# Altium schematic sheet Amplifier.SchDoc
size 594 x 420 mm; SheetNumber: 1; SheetTotal: 1
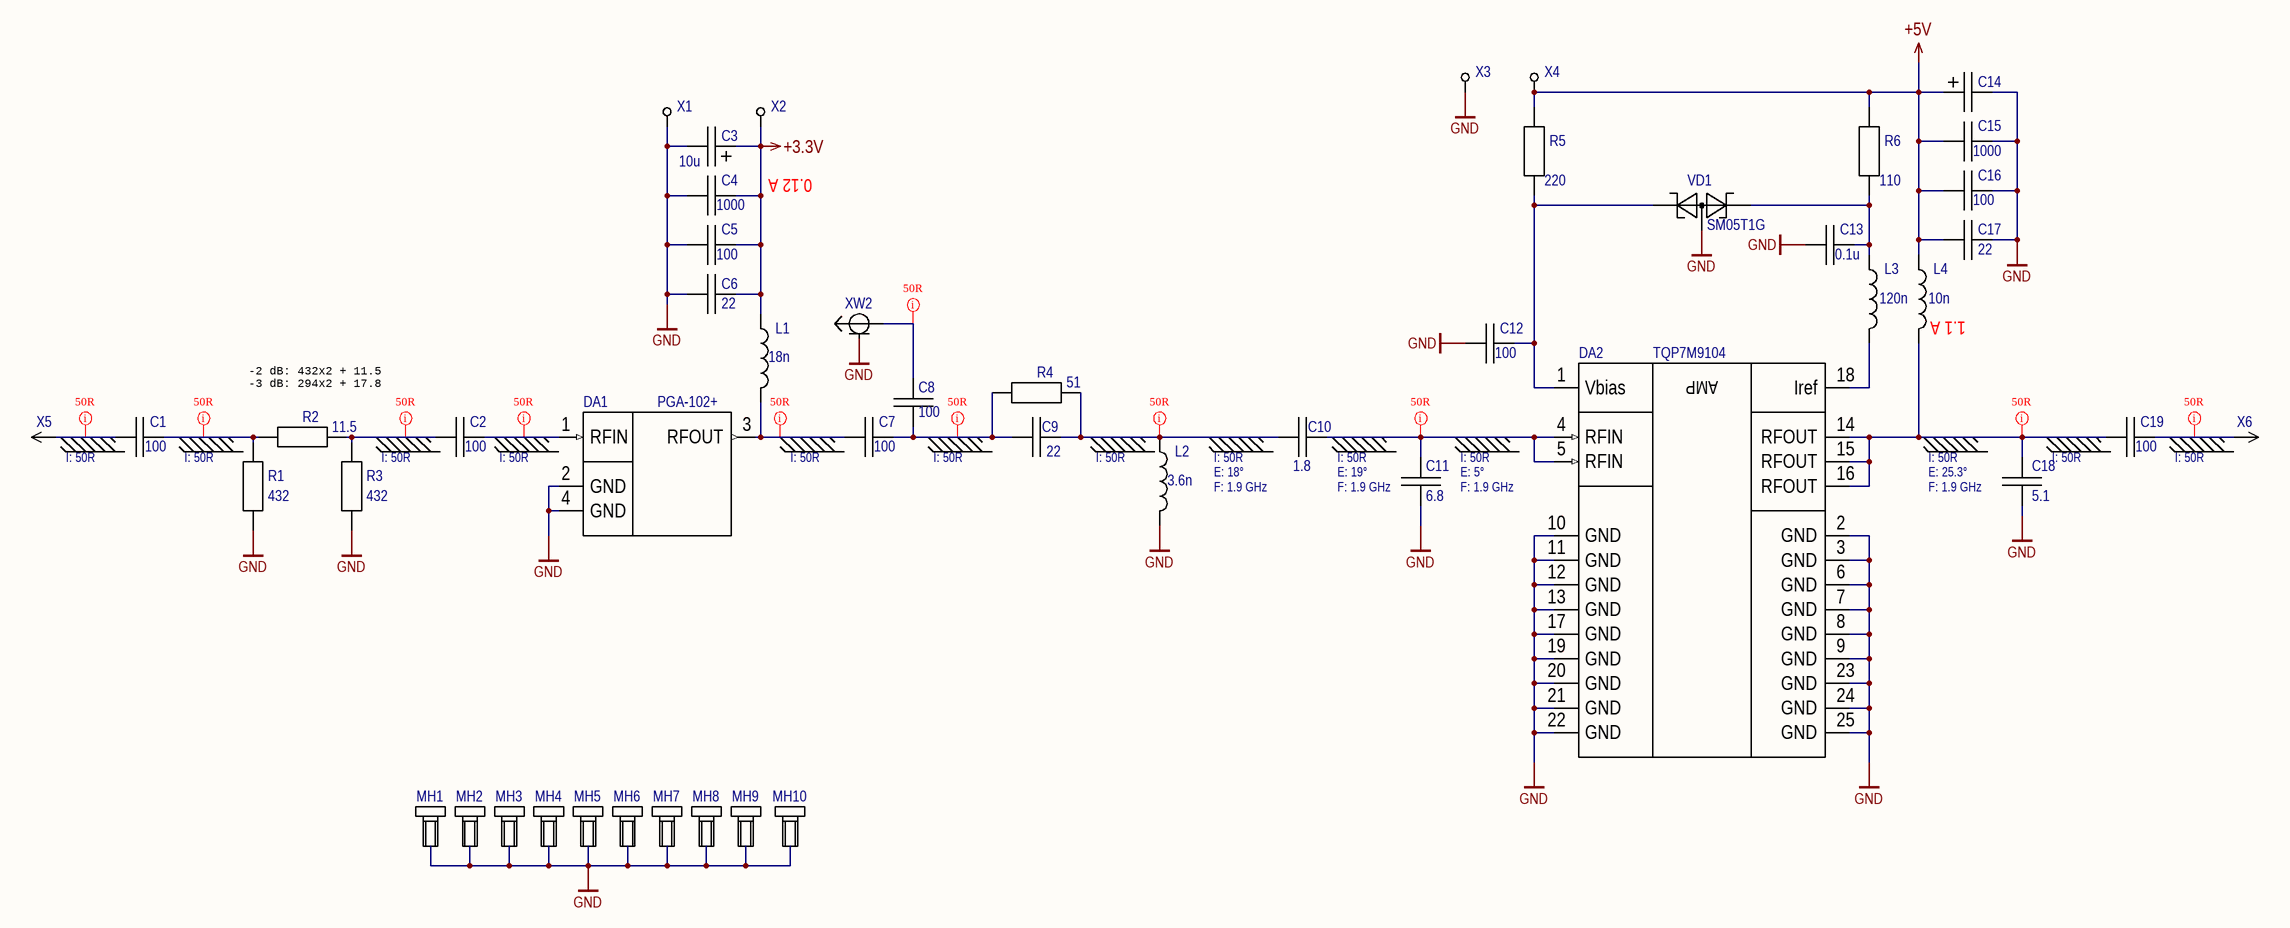
[diagram p0: Amplifier.SchDoc]

## Parts
(Parts that share a designator on the sheet are numbered #1, #2 ... from top to bottom, then left to right.)
?#1  I: 50R  (hidden comment: Microstrip)  (graphical)
?#2  I: 50R  (hidden comment: Microstrip)  (graphical)
?#3  I: 50R  (hidden comment: Microstrip)  (graphical)
?#4  I: 50R  (hidden comment: Microstrip)  (graphical)
?#5  I: 50R  (hidden comment: Microstrip)  (graphical)
?#6  I: 50R  (hidden comment: Microstrip)  (graphical)
?#7  I: 50R  (hidden comment: Microstrip)  (graphical)
?#8  F: 1.9 GHz  E: 18°  I: 50R  (hidden comment: Microstrip)  (graphical)
?#9  F: 1.9 GHz  E: 19°  I: 50R  (hidden comment: Microstrip)  (graphical)
?#10  F: 1.9 GHz  E: 5°  I: 50R  (hidden comment: Microstrip)  (graphical)
?#11  F: 1.9 GHz  E: 25.3°  I: 50R  (hidden comment: Microstrip)  (graphical)
?#12  I: 50R  (hidden comment: Microstrip)  (graphical)
?#13  I: 50R  (hidden comment: Microstrip)  (graphical)
C1  value 100  [CAPC1608X05N]  (hidden comment: *)
C2  value 100  [CAPC1608X05N]  (hidden comment: *)
C3  value 10u  [CAPMP6032X25N-C]  (hidden comment: *)
C4  value 1000  [CAPC1608X05N]  (hidden comment: *)
C5  value 100  [CAPC1608X05N]  (hidden comment: *)
C6  value 22  [CAPC1608X05N]  (hidden comment: *)
C7  value 100  [CAPC1608X05N]  (hidden comment: *)
C8  value 100  [CAPC1608X05N]  (hidden comment: *)
C9  value 22  [CAPC1608X05N]  (hidden comment: *)
C10  value 1.8  [CAPC1608X05N]  (hidden comment: *)
C11  value 6.8  [CAPC1608X05N]  (hidden comment: *)
C12  value 100  [CAPC1608X05N]  (hidden comment: *)
C13  value 0.1u  [CAPC1608X05N]  (hidden comment: *)
C14  *  [CAPMP6032X25N-C]  (value not drawn)
C15  value 1000  [CAPC1608X05N]  (hidden comment: *)
C16  value 100  [CAPC1608X05N]  (hidden comment: *)
C17  value 22  [CAPC1608X05N]  (hidden comment: *)
C18  value 5.1  [CAPC1608X05N]  (hidden comment: *)
C19  value 100  [CAPC1608X05N]  (hidden comment: *)
DA1  PGA-102+  [SOT89-DF782-160P410X160-3N]
DA2  TQP7M9104  [QFN50P400X400X85_HS-25N]
L1  value 18n  [INDC1608X08N]  (hidden comment: I1608)
L2  value 3.6n  [INDC1608X08N]  (hidden comment: I1608)
L3  value 120n  [INDC1608X08N]  (hidden comment: I1608)
L4  Inductance: 10n  [LQW2BH]  (hidden comment: LQW2BHN10NJ13L)
MH1  Винт DIN912 М2  [DIN 912 M2 Electro]  (value not drawn)  (no BOM)
MH2  Винт DIN912 М2  [DIN 912 M2 Electro]  (value not drawn)  (no BOM)
MH3  Винт DIN912 М2  [DIN 912 M2 Electro]  (value not drawn)  (no BOM)
MH4  Винт DIN912 М2  [DIN 912 M2 Electro]  (value not drawn)  (no BOM)
MH5  Винт DIN912 М2  [DIN 912 M2 Electro]  (value not drawn)  (no BOM)
MH6  Винт DIN912 М2  [DIN 912 M2 Electro]  (value not drawn)  (no BOM)
MH7  Винт DIN912 М2  [DIN 912 M2 Electro]  (value not drawn)  (no BOM)
MH8  Винт DIN912 М2  [DIN 912 M2 Electro]  (value not drawn)  (no BOM)
MH9  Винт DIN912 М2  [DIN 912 M2 Electro]  (value not drawn)  (no BOM)
MH10  Винт DIN912 М2  [DIN 912 M2 Electro]  (value not drawn)  (no BOM)
R1  value 432  [RESC1608X05N]  (hidden comment: R1608)
R2  value 11.5  [RESC1608X05N]  (hidden comment: R1608)
R3  value 432  [RESC1608X05N]  (hidden comment: R1608)
R4  value 51  [RESC1608X05N]  (hidden comment: R1608)
R5  value 220  [RESC1608X05N]  (hidden comment: R1608)
R6  value 110  [RESC1608X05N]  (hidden comment: R1608)
VD1  SM05T1G  [SOT95P232X100-3N]
X1  1PINS  [1Pin-3x3]  (value not drawn)  (no BOM)
X2  1PINS  [1Pin-3x3]  (value not drawn)  (no BOM)
X3  1PINS  [1Pin-3x3]  (value not drawn)  (no BOM)
X4  1PINS  [1Pin-3x3]  (value not drawn)  (no BOM)
X5  EdgeConnector  [Edge 704]  (value not drawn)  (no BOM)
X6  EdgeConnector  [Edge 704]  (value not drawn)  (no BOM)
XW2  TE 1909763-1  [UMCC TE 1909763-1]  (value not drawn)

## Nets
+3.3V: C3.1 C4.2 C5.2 C6.1 L1.1 X2.1
+5V: C14.1 C15.1 C16.1 C17.2 L4.1 R5.2 R6.2 X4.1
GND: C3.2 C4.1 C5.1 C6.2 C11.1 C12.1 C13.1 C14.2 C15.2 C16.2 C17.1 C18.1 DA1.2(GND) DA1.4(GND) DA2.2(GND) DA2.3(GND) DA2.6(GND) DA2.7(GND) DA2.8(GND) DA2.9(GND) DA2.10(GND) DA2.11(GND) DA2.12(GND) DA2.13(GND) DA2.17(GND) DA2.19(GND) DA2.20(GND) DA2.21(GND) DA2.22(GND) DA2.23(GND) DA2.24(GND) DA2.25(GND) L2.2 MH1.MH0(A) MH2.MH0(A) MH3.MH0(A) MH4.MH0(A) MH5.MH0(A) MH6.MH0(A) MH7.MH0(A) MH8.MH0(A) MH9.MH0(A) MH10.MH0(A) R1.2 R3.2 VD1.3(A) X1.1 X3.1 XW2.2
NetC1_1: C1.1 X5.1(S)
NetC1_2: C1.2 R1.1 R2.2
NetC2_1: C2.1 R2.1 R3.1
NetC2_2: C2.2 DA1.1(RFIN)
NetC7_1: C7.1 DA1.3(RFOUT) L1.2
NetC7_2: C7.2 C8.1 C9.2 R4.2
NetC8_2: C8.2 XW2.1
NetC9_1: C9.1 C10.2 L2.1 R4.1
NetC10_1: C10.1 C11.2 DA2.4(RFIN) DA2.5(RFIN)
NetC12_2: C12.2 DA2.1(Vbias) R5.1 VD1.1(C1)
NetC13_2: C13.2 L3.1 R6.1 VD1.2(C2)
NetC18_2: C18.2 C19.1 DA2.14(RFOUT) DA2.15(RFOUT) DA2.16(RFOUT) L4.2
NetC19_2: C19.2 X6.1(S)
NetDA2_18: DA2.18(Iref) L3.2

## Layout directives
net class 50R: NetC1_1, NetC1_2, NetC2_1, NetC2_2, NetC7_1, NetC7_2, NetC8_2, NetC9_1, NetC10_1, NetC18_2, NetC19_2

## Notes on the sheet
- 0.12 A
- (near L4) 1.1 A
- (near R2) -2 dB: 432x2 + 11.5
  -3 dB: 294x2 + 17.8
- Перв. примен.
- Справ. №
- Подп. и дата
- Инв. № дубл.
- Взам. инв. №
- Разраб.
- Изм.
- Лист
- № докум.
- Подп.
- Дата
- Лит.
- Масса
- Масштаб
- Пров.
- Т.контр.
- Листов
- Инв. № подл.
- Утв.
- Н.контр.
- 2.106-A2
- Копировал
- Формат А2
- (in symbol TQP7M9104) AMP

## Library data of the parts
?#1-?#7 ?#12 ?#13 = Microstrip: УГО микрополоска; F: 1.8 GHz; E: 45°; ClassName: *
?#8-?#11 = Microstrip: УГО микрополоска; ClassName: *
C1 C2 C5 C7 C8 C12 C16 C19 = CC1608: Конденсатор 1.6x0.8 мм; Manufacturer: Murata Electronics; Manufacturer Part Number: GCM1885C2A101FA16D; Tolerance: ±1%; ТКЕ: C0G; РКД Наименование: CC1608M - NP0 - 100 V - 100 pF ±1%; Voltage: 100; Type: *; PartNo: *; Supplier Part Number 1: C527967; Supplier 1: LCSC
  C1 C2 C5: ClassName: LNA
  C7 C8 C12 C16 C19: ClassName: Power
C3 = CT6032-C: Tantalum Surface Mount Capacitor, Size C; Manufacturer: Vishay Intertech; Manufacturer Part Number: 293D106X9016C2TE3; Voltage: 16; Type: *; PartNo: *; Supplier Part Number 1: C130372; Supplier 1: LCSC; Tolerance: *; ClassName: LNA
C4 C15 = CC1608: Конденсатор 1.6x0.8 мм; Manufacturer: Murata Electronics; Manufacturer Part Number: GRM1885C1H102JA01D; Voltage: 50; Tolerance: ±5%; ТКЕ: C0G; РКД Наименование: CC1608M - NP0 - 50 V - 1 nF ±5%; Type: *; PartNo: *; Supplier Part Number 1: C77026; Supplier 1: LCSC
  C4: ClassName: LNA
  C15: ClassName: Power
C6 C9 C17 = CC1608: Конденсатор 1.6x0.8 мм; Manufacturer: Vishay Intertech; Manufacturer Part Number: VJ0603A220FXACW1BC; Voltage: 50; Tolerance: ±1%; ТКЕ: C0G; РКД Наименование: CC1608M - NP0 - 50 V - 22 pF ±1%; Type: *; PartNo: *; Supplier Part Number 1: C2182228; Supplier 1: LCSC
  C6: ClassName: LNA
  C9 C17: ClassName: Power
C10 = CC1608: Конденсатор 1.6x0.8 мм; Manufacturer: YAGEO; Manufacturer Part Number: CC0603BRNPO9BN1R8; Voltage: 50; Tolerance: ±0.1 pF; ТКЕ: C0G; РКД Наименование: CC1608M - NP0 - 50 V - 1.8 pF ±0.1pF; Type: *; PartNo: *; Supplier Part Number 1: C282244; Supplier 1: LCSC; ClassName: Power
C11 = CC1608: Конденсатор 1.6x0.8 мм; Manufacturer: YAGEO; Manufacturer Part Number: CC0603BRNPO9BN6R8; Voltage: 50; Tolerance: ±0.1pF; ТКЕ: C0G; РКД Наименование: CC1608M - NP0 - 50 V - 6.8 pF ±0.1 pF; Type: *; PartNo: *; Supplier Part Number 1: C519114; Supplier 1: LCSC; ClassName: Power
C13 = CC1608: Конденсатор 1.6x0.8 мм; Manufacturer: Murata Electronics; Manufacturer Part Number: GRM188R71H104KA93D; Voltage: 50; Tolerance: ±10%; ТКЕ: X7R; РКД Наименование: CC1608M -X7R - 50 V - 0.1 uF ±10%; Type: *; PartNo: *; Supplier Part Number 1: C77055; Supplier 1: LCSC; ClassName: Power
C14 = CT6032-C: Tantalum Surface Mount Capacitor, Size C; Manufacturer: Vishay Intertech; Manufacturer Part Number: 293D106X9016C2TE3; Value: 10u; Voltage: 16; Type: *; PartNo: *; Supplier Part Number 1: C130372; Supplier 1: LCSC; Tolerance: *; ClassName: Power
C18 = CC1608: Конденсатор 1.6x0.8 мм; Manufacturer: YAGEO; Manufacturer Part Number: CC0603BRNPO9BN5R1; Voltage: 50; Tolerance: ±0.1 pF; ТКЕ: C0G; РКД Наименование: CC1608M - NP0 - 50 V - 5.1 pF ±0.1 pF; Type: *; PartNo: *; Supplier Part Number 1: C519110; Supplier 1: LCSC; ClassName: Power
DA1 = PGA-102+: MonolithicAmplifier, UltraHighDynamicRange, 50ohm, 0.05 to 6 GHz; Manufacturer: Mini-Circuits; Supplier 1: LCSC; Manufacturer Part Number: PGA-102+; RoHS: Yes; Category: RF Amplifiers; Stock 1: 4202; Pricing 1: 1=3,25, 10=3,1, 20=2,952, 50=2,112, 100=2,028, 200=1,944, 500=1,86 (USD); RoHS Compliant: Yes; Supplier Part Number 1: C3193264; ClassName: LNA
DA2 = TQP7M9104: RF Amp Single Driver Amp 2.2GHz 5.25V 24-Pin QFN EP; Manufacturer: Qorvo; Supplier 1: LCSC; Manufacturer Part Number: TQP7M9104; RoHS: Yes; Category: RF Amplifiers; Stock 1: 3113; Pricing 1: 1=17,08, 10=17,08, 50=12,4, 100=10,06, 1000=6,78, 10000=6,65 (USD); Supplier Part Number 1: C471175; ClassName: Power
L1 = I1608: Катушка 1.6x0.8 мм; Manufacturer: FH; Manufacturer Part Number: FHW0603UC018JST; Current: *; PartNo: *; Supplier 1: LCSC; Supplier Part Number 1: C295695; ClassName: LNA
L2 = I1608: Катушка 1.6x0.8 мм; Manufacturer: FH; Manufacturer Part Number: FHW0603UC3N6JST; Current: *; PartNo: *; Supplier 1: LCSC; Supplier Part Number 1: C304270; ClassName: Power
L3 = I1608: Катушка 1.6x0.8 мм; Manufacturer: FH; Manufacturer Part Number: FHW0603UCR12JST; Current: *; PartNo: *; Supplier 1: LCSC; Supplier Part Number 1: C317988; ClassName: Power
L4 = LQW2BHN10NJ13L: Inductor RF Chip Wirewound 10nH 5% 100MHz 35Q-Factor 1.32A 30mOhm DCR 0805 Embossed T/R; Manufacturer: Murata; Core Material: Non-Magnetic,Ferrite; Q Factor: 35; Shielding: Unshielded; Self Resonant Frequency: 3.3GHz; DC Resistance (DCR): 30mR; Value: 10n; Supplier 1: Digikey; Manufacturer Part Number: LQW2BHN10NJ13L; RoHS: Yes; Category: Fixed Inductors; Stock 1: 1980; Pricing 1: 1=0,41, 10=0,334, 25=0,3088, 50=0,283, 100=0,2495, 250=0,2418, 500=0,21608, 1000=0,17492 (USD); Mount: Surface Mount; Case/Package: 0805; Weight: 0.000317oz; Case Code (Metric): 2012; Case Code (Imperial): 0805; Min Operating Temperature: -40°C; Max Operating Temperature: 85°C; Tolerance: 5%; Max DC Current: 1.32A; Packaging: Tape and Reel; Package Quantity: 2000; Termination: SMD/SMT; Series: LQW2BH_13; Current Rating: 1.32A; Test Frequency: 100MHz; DC Current: 1.32A; Length: 2mm; Width: 0.059inch; Height: 1.7mm; Depth: 1.7mm; Height - Seated (Max): 0.07inch; Radiation Hardening: No; RoHS Compliant: Yes; Military Standard: Not; ComponentLink1URL: https://datasheet.ciiva.com/30490/0900766b81256294-30490160.pdf?src-supplier=Rs; ComponentLink1Description: https://datasheet.ciiva.com/30490/0900766b81256294-30490160.pdf?src-supplier=Rs; ComponentLink2URL: https://datasheet.ciiva.com/8508/l0075s0081lqw2bh-13-8508518.pdf?src-supplier=Avnet; ComponentLink2Description: https://datasheet.ciiva.com/8508/l0075s0081lqw2bh-13-8508518.pdf?src-supplier=Avnet; Supplier Part Number 1: 490-11779-1-ND; ClassName: Power
MH1-MH10 = Винт DIN 912 М2: Винт DIN 912 цилиндрическая головка внутренний шестигранник М2
R1 R3 = R1608: Резистор 1.6x0.8 мм; Manufacturer: YAGEO; Manufacturer Part Number: RC0603FR-07432RL; Tolerance: ±1%; РКД Наименование: RC1608M - 432 Ohm ±1%; Type: *; PartNo: *; Supplier 1: LCSC; Supplier Part Number 1: C245969; ClassName: LNA
R2 = R1608: Резистор 1.6x0.8 мм; Manufacturer: YAGEO; Manufacturer Part Number: RC0603FR-0711R5L; Tolerance: ±1%; РКД Наименование: RC1608M - 11.5 Ohm ±1%; Type: *; PartNo: *; Supplier 1: LCSC; Supplier Part Number 1: C245901; ClassName: LNA
R4 = R1608: Резистор 1.6x0.8 мм; Manufacturer: YAGEO; Manufacturer Part Number: RC0603FR-0751RL; Tolerance: ±1%; РКД Наименование: RC1608M - 51 Ohm ±1%; Type: *; PartNo: *; Supplier 1: LCSC; Supplier Part Number 1: C114628; ClassName: Power
R5 = R1608: Резистор 1.6x0.8 мм; Manufacturer: YAGEO; Manufacturer Part Number: RC0603FR-07220RL; Tolerance: ±1%; РКД Наименование: RC1608M - 220 Ohm ±1%; Type: *; PartNo: *; Supplier 1: LCSC; Supplier Part Number 1: C107696; ClassName: Power
R6 = R1608: Резистор 1.6x0.8 мм; Manufacturer: YAGEO; Manufacturer Part Number: RC0603FR-07110RL; Tolerance: ±1%; РКД Наименование: RC1608M - 110 Ohm ±1%; Type: *; PartNo: *; Supplier 1: LCSC; Supplier Part Number 1: C141676; ClassName: Power
VD1 = SM05T1G: SM05T1 Series 7.3 V 300 W Transient Voltage Suppressor Diode Array - SOT-23-3; Manufacturer: UMW; Voltage Rating (DC): 5V; Supplier 1: LCSC; Manufacturer Part Number: SM05T1G; RoHS: Yes; Category: ESD and Circuit Protection ICs; Stock 1: 80742; Pricing 1: 1=0,34, 10=0,207, 100=0,1296, 500=0,09596, 1000=0,08508 (USD); Lead Free: 5697LeadFree; ComponentLink1URL: https://datasheet.ciiva.com/11193/sm12t1-d-11193492.pdf?src-supplier=Avnet; ComponentLink1Description: https://datasheet.ciiva.com/11193/sm12t1-d-11193492.pdf?src-supplier=Avnet; ComponentLink2URL: https://datasheet.ciiva.com/4508/sm12t1-d-196357-4508787.pdf?src-supplier=Mouser; ComponentLink2Description: https://datasheet.ciiva.com/4508/sm12t1-d-196357-4508787.pdf?src-supplier=Mouser; ComponentLink3URL: https://datasheet.ciiva.com/15143/getdatasheetpartid-69008-15143230.pdf?src-supplier=Verical; ComponentLink3Description: https://datasheet.ciiva.com/15143/getdatasheetpartid-69008-15143230.pdf?src-supplier=Verical; ComponentLink4URL: https://datasheet.ciiva.com/11193/sm12t1-d-11193495.pdf?src-supplier=Avnet; ComponentLink4Description: https://datasheet.ciiva.com/11193/sm12t1-d-11193495.pdf?src-supplier=Avnet; ComponentLink5URL: https://datasheet.ciiva.com/339/sm05t1-d-339928.pdf?src-supplier=Digikey; ComponentLink5Description: https://datasheet.ciiva.com/339/sm05t1-d-339928.pdf?src-supplier=Digikey; ComponentLink6URL: https://datasheet.ciiva.com/339/sm05t1-d-339929.pdf?src-supplier=Digikey; ComponentLink6Description: https://datasheet.ciiva.com/339/sm05t1-d-339929.pdf?src-supplier=Digikey; ComponentLink7URL: https://datasheet.ciiva.com/339/sm05t1-d-339930.pdf?src-supplier=Digikey; ComponentLink7Description: https://datasheet.ciiva.com/339/sm05t1-d-339930.pdf?src-supplier=Digikey; ComponentLink8URL: https://datasheet.ciiva.com/22661/1708353-22661174.pdf?src-supplier=Element14; ComponentLink8Description: https://datasheet.ciiva.com/22661/1708353-22661174.pdf?src-supplier=Element14; ComponentLink9URL: https://datasheet.ciiva.com/16199/sm12t1-d-16199269.pdf?src-supplier=Future+Electronics; ComponentLink9Description: https://datasheet.ciiva.com/16199/sm12t1-d-16199269.pdf?src-supplier=Future+Electronics; Supplier Part Number 1: C5199846; ClassName: Power
X1-X4 = 1PINS: Точки пайки с отверстием и без; ClassName: *
X5 X6 = EdgeConnector: Полосок для подключения СВЧ контакта
XW2 = Разъем UMCC TE 1909763-1: Разъем UMCC, микрополосок; Manufacturer: TE Connectivity AMP; Body Material: Liquid Crystal Polymer,Polymer; Body Plating: Gold; Dielectric Material: Polymer; Impedance: 50R; Max Frequency: 6GHz; Connector Type: Jack; Gender: Female; Connector System: Cable-to-Board; Number of Positions: 1; Sealable: No (Without); РКД Наименование: 1909763-1 - UMCC разъем, TE Connectivity; Supplier 1: LCSC; Manufacturer Part Number: 1909763-1; Stock 1: 119207; Pricing 1: 1=0.5, 10=0.472, 100=0.3615, 500=0.3144, 1000=0.2594 (USD); Mount: Panel; Case/Package: SMD/SMT; Contact Plating: Gold; Contact Material: Copper Alloy; Housing Color: Beige; Insulation Material: Thermoplastic; Min Operating Temperature: -40°C; Max Operating Temperature: 194°C; Packaging: Tape and Reel; Package Quantity: 1; Fastening Type: Pull,Push; Termination: SMD/SMT; Orientation: Straight; Frequency: 6GHz; Length: 3mm; Radiation Hardening: No; ELV: Compliant; Lead Free: Lead Free; ComponentLink1URL: http://www.te.com/commerce/DocumentDelivery/DDEController?Action=showdoc&DocId=Customer+Drawing%7F1909763%7FB%7Fpdf%7FEnglish%7FENG_CD_1909763_B.pdf%7F1909763-1&src-supplier=Future+Electronics; ComponentLink1Description: http://www.te.com/commerce/DocumentDelivery/DDEController?Action=showdoc&DocId=Customer+Drawing%7F1909763%7FB%7Fpdf%7FEnglish%7FENG_CD_1909763_B.pdf%7F1909763-1&src-supplier=Future+Electronics; ComponentLink2URL: http://www.te.com/commerce/DocumentDelivery/DDEController?Action=showdoc&DocId=Customer+Drawing%7F1909763%7FB%7Fpdf%7FEnglish%7FENG_CD_1909763_B.pdf%7F1909763-1&src-supplier=Avnet+Asia; ComponentLink2Description: http://www.te.com/commerce/DocumentDelivery/DDEController?Action=showdoc&DocId=Customer+Drawing%7F1909763%7FB%7Fpdf%7FEnglish%7FENG_CD_1909763_B.pdf%7F1909763-1&src-supplier=Avnet+Asia; ComponentLink3URL: http://www.te.com/commerce/DocumentDelivery/DDEController?Action=showdoc&DocId=Customer+Drawing%7F1909763%7FB%7Fpdf%7FEnglish%7FENG_CD_1909763_B.pdf%7F1909763-1&src-supplier=Avnet; ComponentLink3Description: http://www.te.com/commerce/DocumentDelivery/DDEController?Action=showdoc&DocId=Customer+Drawing%7F1909763%7FB%7Fpdf%7FEnglish%7FENG_CD_1909763_B.pdf%7F1909763-1&src-supplier=Avnet; ComponentLink4URL: https://www.te.com/commerce/DocumentDelivery/DDEController?Action=srchrtrv&DocNm=1909763&DocType=Customer+Drawing&DocLang=English&src-supplier=Digi-Key; ComponentLink4Description: https://www.te.com/commerce/DocumentDelivery/DDEController?Action=srchrtrv&DocNm=1909763&DocType=Customer+Drawing&DocLang=English&src-supplier=Digi-Key; Supplier Part Number 1: C392444; ClassName: Power